# EAGLE design OttoPi04a (EAGLE 9.6.2)
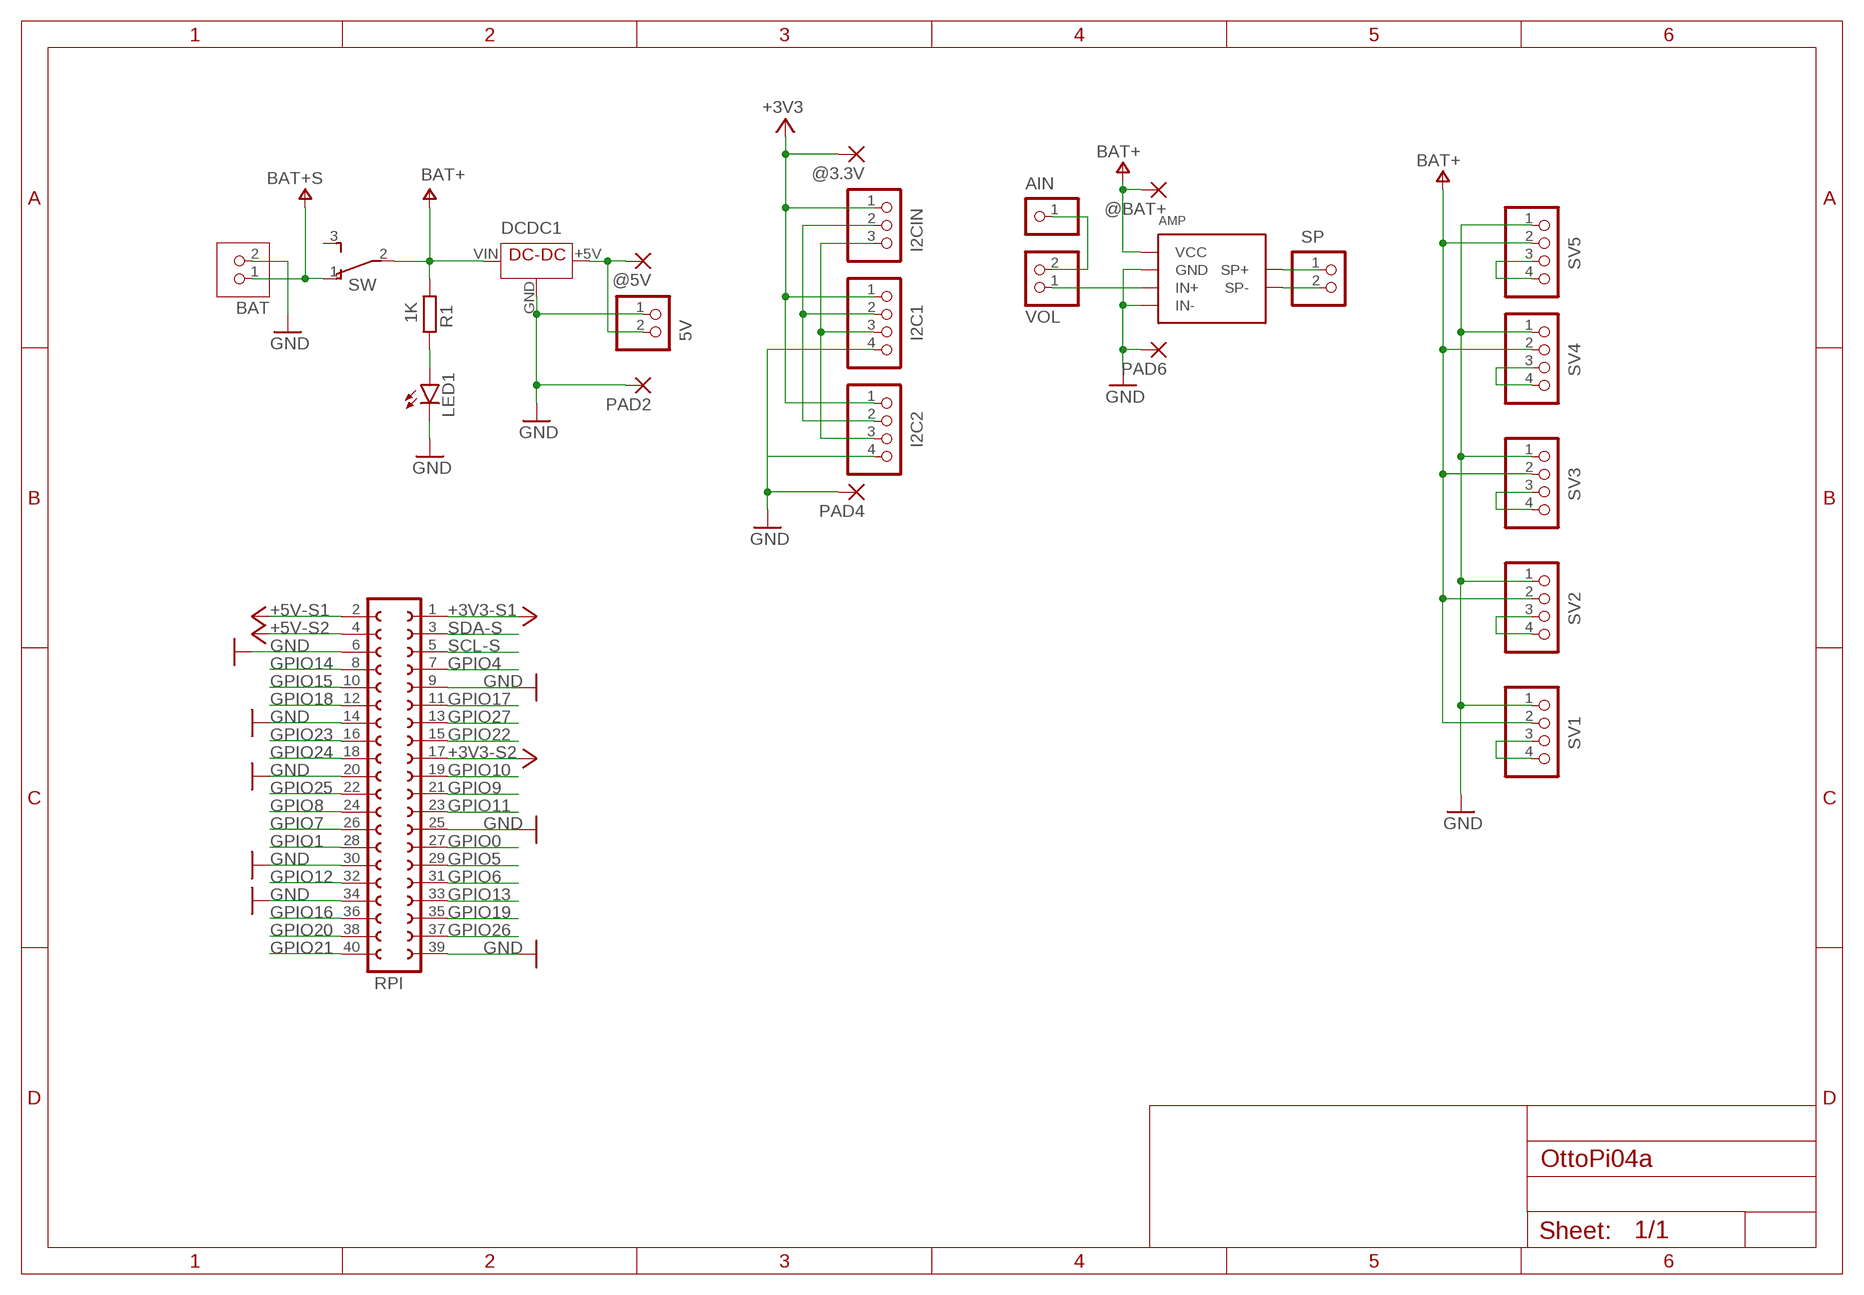
[diagram p0: schematic, sheet 1]

## Parts
5V  PINHD-1X2  [1X02]
@3.3V  1,6/0,9  [1,6/0,9]
@5V  1,6/0,9  [1,6/0,9]
@BAT+  1,6/0,9  [1,6/0,9]
AIN  PINHD-1X1  [1X01]
AMP  PAM8012MOD  [PAM8012MOD-A]
BAT  JST-PH2  [JST-PH2]
DCDC1  DCDC-5V-0.48A  [DCDC-5V-0.48A]
I2C1  PINHD-1X4  [1X04]
I2C2  PINHD-1X4  [1X04]
I2CIN  PINHD-1X3  [1X03]
LED1  LED3MM  [LED3MM]
PAD2  1,6/0,9  [1,6/0,9]
PAD4  1,6/0,9  [1,6/0,9]
PAD6  1,6/0,9  [1,6/0,9]
R1  1K  R-EU_0204/7  [0204/7]
RPI  FE20-2  [FE20-2]
SP  PINHD-1X2  [1X02]
SV1  PINHD-1X4  [1X04]
SV2  PINHD-1X4  [1X04]
SV3  PINHD-1X4  [1X04]
SV4  PINHD-1X4  [1X04]
SV5  PINHD-1X4  [1X04]
SW  TL36PO  [TL3XPO]
VOL  PINHD-1X2  [1X02]

## Nets
+3V3: @3.3V.1(P) I2C1.1 I2C2.1 I2CIN.1
+3V3-S1: RPI.1 ; supply symbol labelled +3V3
+3V3-S2: RPI.17 ; supply symbol labelled +3V3
+4V_S: BAT.1 SW.1(O) ; supply symbol labelled BAT+S
+5V: 5V.2 @5V.1(P) DCDC1.+5V(VOUT)
+5V-S1: RPI.2 ; supply symbol labelled +5V
+5V-S2: RPI.4 ; supply symbol labelled +5V
AIN: AMP.IN+ VOL.1
GND: 5V.1 AMP.GND AMP.IN- BAT.2 DCDC1.GND I2C1.4 I2C2.4 LED1.K(C) PAD2.1(P) PAD4.1(P) PAD6.1(P) RPI.6 RPI.9 RPI.14 RPI.20 RPI.25 RPI.30 RPI.34 RPI.39 SV1.1 SV2.1 SV3.1 SV4.1 SV5.1
GPIO0: RPI.27
GPIO1: RPI.28
GPIO4: RPI.7
GPIO5: RPI.29
GPIO6: RPI.31
GPIO7: RPI.26
GPIO8: RPI.24
GPIO9: RPI.21
GPIO10: RPI.19
GPIO11: RPI.23
GPIO12: RPI.32
GPIO13: RPI.33
GPIO14: RPI.8
GPIO15: RPI.10
GPIO16: RPI.36
GPIO17: RPI.11
GPIO18: RPI.12
GPIO19: RPI.35
GPIO20: RPI.38
GPIO21: RPI.40
GPIO22: RPI.15
GPIO23: RPI.16
GPIO24: RPI.18
GPIO25: RPI.22
GPIO26: RPI.37
GPIO27: RPI.13
LED: LED1.A R1.1
N$1: AIN.1 VOL.2
SCL: I2C1.3 I2C2.3 I2CIN.3
SCL-S: RPI.5
SDA-S: RPI.3
SDL: I2C1.2 I2C2.2 I2CIN.2
SP+: AMP.SP+@1(SP+) SP.1
SP-: AMP.SP-@1(SP-) SP.2
SV1: SV1.3 SV1.4
SV2: SV2.3 SV2.4
SV3: SV3.3 SV3.4
SV4: SV4.3 SV4.4
SV5: SV5.3 SV5.4
V+: @BAT+.1(P) AMP.V+(VCC) DCDC1.VIN R1.2 SV1.2 SV2.2 SV3.2 SV4.2 SV5.2 SW.2(P) ; supply symbol labelled BAT+
Unconnected: SW.3(S)

## Library data of the parts
5V SP VOL = pinhead:PINHD-1X2: PIN HEADER
@3.3V @5V @BAT+ PAD2 PAD4 PAD6 = wirepad:1,6/0,9: THROUGH-HOLE PAD
AIN = pinhead:PINHD-1X1: PIN HEADER
AMP = ytani1:PAM8012MOD: PAM8012使用2W D級アンプモジュール https://akizukidenshi.com/catalog/g/gK-08217/ Vin: 2.5V-5.5V 8ohm: 1W 4ohm: 2W IN-をGNDに接続することでシングルエンド入力としても使用できます。; CHIP1: PAM8012; OC_AKIZUKI: K-08217; URL_AKIZUKI: https://akizukidenshi.com/catalog/g/gK-08217/
BAT = ytani1:JST-PH2
DCDC1 = ytani1:DCDC-5V-0.48A: DC-DC step up converter T64 https://www.amazon.co.jp/gp/product/B07N8TBJB3/ Vin: 0.9V-5V Vout: 5V; URL_AMAZON: https://www.amazon.co.jp/gp/product/B07N8TBJB3/
I2C1 I2C2 SV1-SV5 = pinhead:PINHD-1X4: PIN HEADER
I2CIN = pinhead:PINHD-1X3: PIN HEADER
LED1 = led:LED: LED OSRAM: - CHIPLED LG R971, LG N971, LY N971, LG Q971, LY Q971, LO R971, LY R971 LH N974, LH R974 LS Q976, LO Q976, LY Q976 LO Q996 - Hyper CHIPLED LW Q18S LB Q993, LB Q99A, LB R99A - SideLED LS A670, LO A670, LY A670, LG A670, LP A670 LB A673, LV A673, LT A673, LW A673 LH A674 LY A675 LS A676, LA A676, LO A676, LY A676, LW A676 LS A679, LY A679, LG A679 - Hyper Micro SIDELED® LS Y876, LA Y876, LO Y876, LY Y876 LT Y87S - SmartLED LW L88C, LW L88S LB L89C, LB L89S, LG L890 LS L89K, LO L89K, LY L89K LS L896, LA L896, LO L896, LY L896 - TOPLED LS T670, LO T670, LY T670, LG T670, LP T670 LSG T670, LSP T670, LSY T670, LOP T670, LYG T670 LG T671, LOG T671, LSG T671 LB T673, LV T673, LT T673, LW T673 LH T674 LS T676, LA T676, LO T676, LY T676, LB T676, LH T676, LSB T676, LW T676 LB T67C, LV T67C, LT T67C, LS T67K, LO T67K, LY T67K, LW E67C LS E67B, LA E67B, LO E67B, LY E67B, LB E67C, LV E67C, LT E67C LW T67C LS T679, LY T679, LG T679 LS T770, LO T770, LY T770, LG T770, LP T770 LB T773, LV T773, LT T773, LW T773 LH T774 LS E675, LA E675, LY E675, LS T675 LS T776, LA T776, LO T776, LY T776, LB T776 LHGB T686 LT T68C, LB T68C - Hyper Mini TOPLED® LB M676 - Mini TOPLED Santana® LG M470 LS M47K, LO M47K, LY M47K Source: http://www.osram.convergy.de LUXEON: - LUMILED® LXK2-PW12-R00, LXK2-PW12-S00, LXK2-PW14-U00, LXK2-PW14-V00 LXK2-PM12-R00, LXK2-PM12-S00, LXK2-PM14-U00 LXK2-PE12-Q00, LXK2-PE12-R00, LXK2-PE12-S00, LXK2-PE14-T00, LXK2-PE14-U00 LXK2-PB12-K00, LXK2-PB12-L00, LXK2-PB12-M00, LXK2-PB14-N00, LXK2-PB14-P00, LXK2-PB14-Q00 LXK2-PR12-L00, LXK2-PR12-M00, LXK2-PR14-Q00, LXK2-PR14-R00 LXK2-PD12-Q00, LXK2-PD12-R00, LXK2-PD12-S00 LXK2-PH12-R00, LXK2-PH12-S00 LXK2-PL12-P00, LXK2-PL12-Q00, LXK2-PL12-R00 Source: www.luxeon.com KINGBRIGHT: KA-3528ASYC Source: www.kingbright.com
R1 = rcl:R-EU_: RESISTOR, European symbol; SPICEPREFIX: R
RPI = con-lsta:FE20-2: FEMALE HEADER; OC_FARNELL: unknown; OC_NEWARK: unknown
SW = switch:TL36PO: TINY SWITCH ON - ON Source: http://www2.produktinfo.conrad.com/datenblaetter/700000-724999/705152-da-01-de-Subminiaturschalter_TL_36YO.pdf

## Net classes
0 default: clearance 0.254 mm
1 V+: width 0.1 mm

## Board
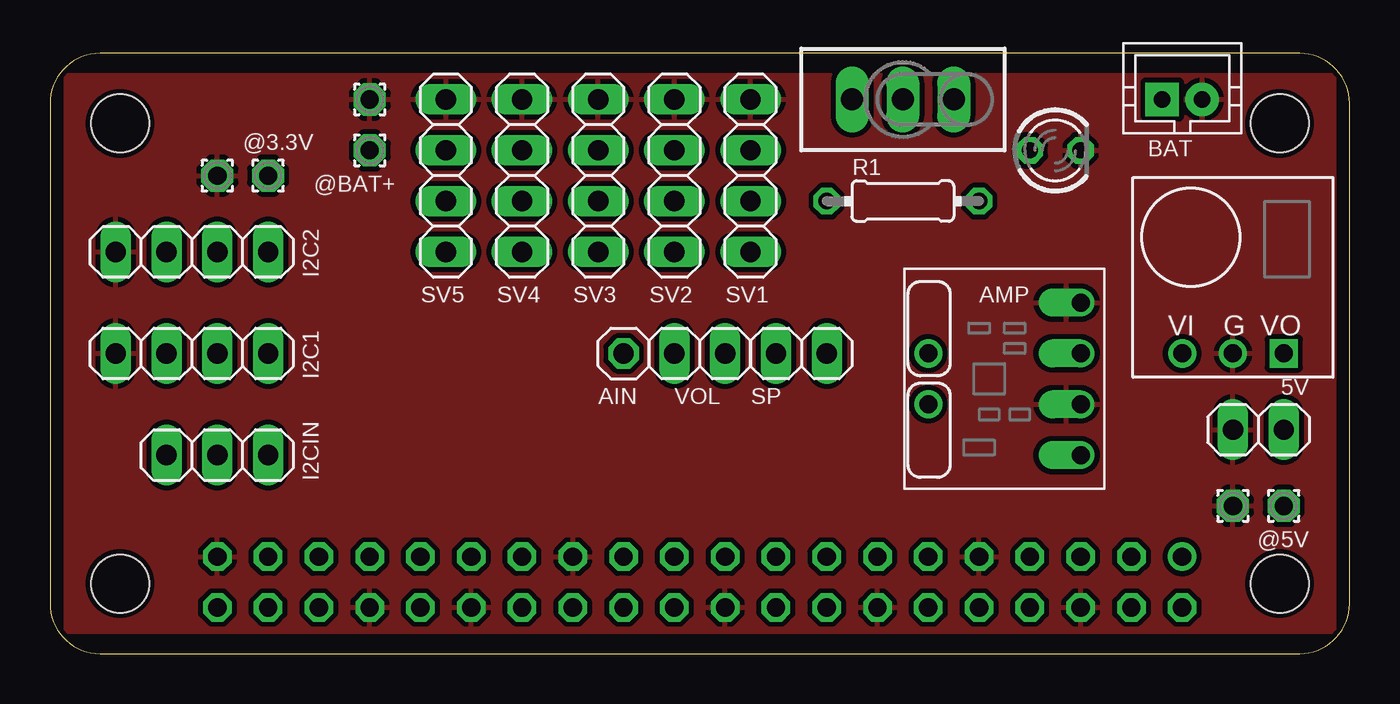
[diagram p1: board, top side]
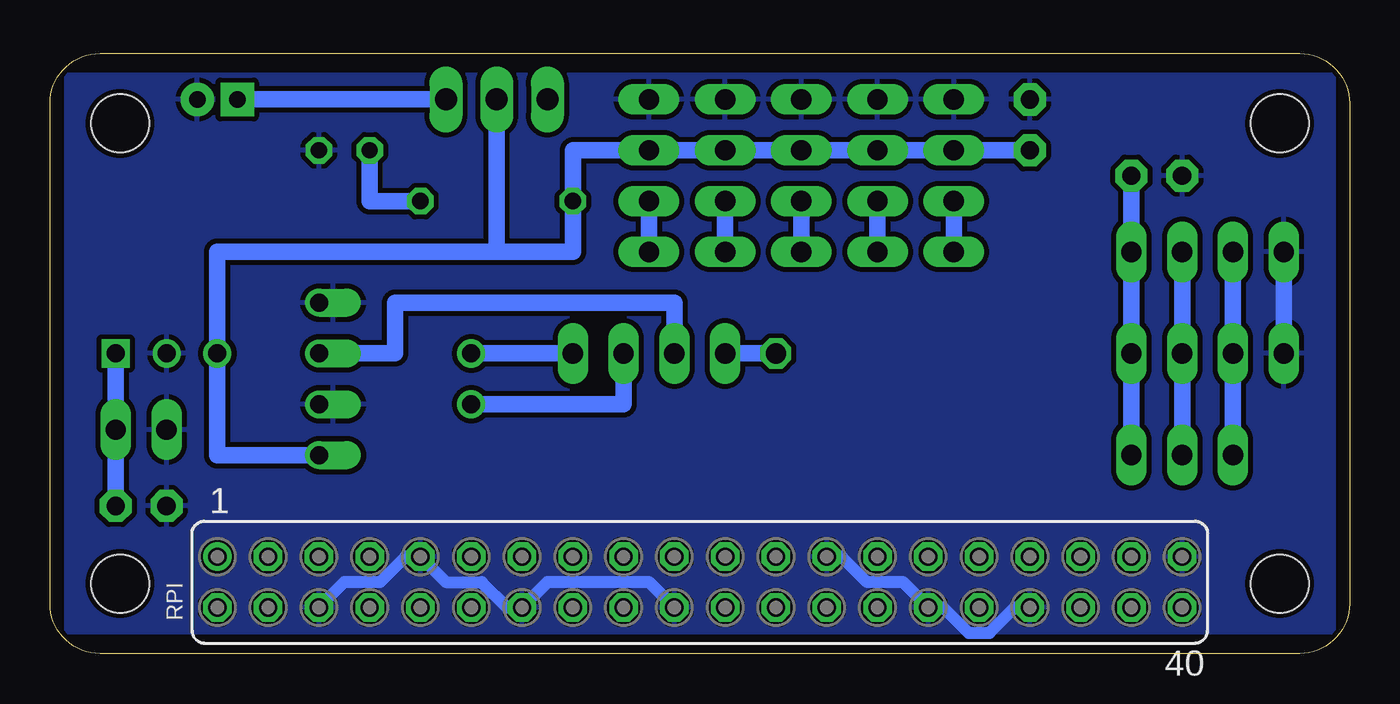
[diagram p2: board, bottom side, seen from below]

Size 65 x 30 mm. Coordinates in mm from the lower left corner, seen from the top.
Outline: 0,27.5 0,2.5 arc90 2.5,0 62.5,0 arc90 65,2.5 65,27.5 arc90 62.5,30 2.5,30 arc90 0,27.5
Copper layers (1*16): Top 0.035mm / dielectric 1.5mm / Bottom 0.035mm
Design rules "SeeedStudio_2layer_DRU_no_angle_20140221": minimum track width 6mil, minimum drill 12mil, track to track 6mil, track to pad 6mil, pad to pad 6mil, via to via 6mil, smd to smd 0mil, copper to edge 10mil, drill to drill 10mil, minimum pad ring 10mil, minimum via ring 6mil, stop-mask expansion 2mil, vias tented up to drill 100mil, thermal gap 10mil
Holes 2.9 mm at 3.5,3.5 61.5,3.5 3.5,26.5 61.5,26.5

### Footprints (pad centres in the part's own frame; a part is rotated, then mirrored left to right if it is on the bottom)
1X02 = drill 1.016 long: 1 -1.27,0; 2 1.27,0
1,6/0,9 = drill 0.914 pad 1.6 octagon: 1 0,0
1X01 = drill 1.016 octagon: 1 0,0
PAM8012MOD-A = drill 0.9 offset: GND -3.81,1.27; IN+ -3.81,-1.27; IN- -3.81,-3.81; V+ -3.81,3.81 | drill 0.9: SP+@1 3.81,1.27; SP-@1 3.81,-1.27
JST-PH2 = drill 0.813 pad 1.676 square: 1 -1,0 | drill 0.813 pad 1.676: 2 1,0
DCDC-5V-0.48A = drill 0.9 square: +5V -2.54,3.81 | drill 0.9: GND 0,3.81; VIN 2.54,3.81
1X04 = drill 1.016 long: 1 -3.81,0; 2 -1.27,0; 3 1.27,0; 4 3.81,0
1X03 = drill 1.016 long: 1 -2.54,0; 2 0,0; 3 2.54,0
LED3MM = drill 0.813 octagon: A -1.27,0; K 1.27,0
0204/7 = drill 0.813 octagon: 1 -3.81,0; 2 3.81,0
FE20-2 = drill 0.914: 1 -24.13,1.27 | drill 0.914 octagon: 2 -24.13,-1.27; 3 -21.59,1.27; 4 -21.59,-1.27; 5 -19.05,1.27; 6 -19.05,-1.27; 7 -16.51,1.27; 8 -16.51,-1.27; 9 -13.97,1.27; 10 -13.97,-1.27; 11 -11.43,1.27; 12 -11.43,-1.27; 13 -8.89,1.27; 14 -8.89,-1.27; 15 -6.35,1.27; 16 -6.35,-1.27; 17 -3.81,1.27; 18 -3.81,-1.27; 19 -1.27,1.27; 20 -1.27,-1.27; 21 1.27,1.27; 22 1.27,-1.27; 23 3.81,1.27; 24 3.81,-1.27; 25 6.35,1.27; 26 6.35,-1.27; 27 8.89,1.27; 28 8.89,-1.27; 29 11.43,1.27; 30 11.43,-1.27; 31 13.97,1.27; 32 13.97,-1.27; 33 16.51,1.27; 34 16.51,-1.27; 35 19.05,1.27; 36 19.05,-1.27; 37 21.59,1.27; 38 21.59,-1.27; 39 24.13,1.27; 40 24.13,-1.27
TL3XPO = drill 1.1 pad 1.422 long: 1 -2.54,0; 2 0,0; 3 2.54,0

### Placement (x,y rotation side)
5V  60.44,11.19 0 top
@3.3V  10.91,23.89 0 top
@5V  61.71,7.38 0 top
@BAT+  15.99,25.16 0 top
AIN  28.69,15 90 top
AMP  47.74,13.73 180 top
BAT  56.63,27.7 0 top
DCDC1  59.17,18.81 180 top
I2C1  7.1,15 180 top
I2C2  7.1,20.08 180 top
I2CIN  8.37,9.92 180 top
LED1  50.28,25.16 0 top
PAD2  59.17,7.38 0 top
PAD4  8.37,23.89 0 top
PAD6  15.99,27.7 0 top
R1  42.66,22.62 180 top
RPI  32.5,3.57 0 bottom
SP  37.58,15 0 top
SV1  35.04,23.89 270 top
SV2  31.23,23.89 270 top
SV3  27.42,23.89 270 top
SV4  23.61,23.89 270 top
SV5  19.8,23.89 270 top
SW  42.66,27.7 180 top
VOL  32.5,15 180 top

### Tracks (layer width: path | path; a pad name or v marks a point on that pad's centre or on a via)
+3V3
  Bottom 0.813: I2CIN.1 I2C1.1 I2C2.1 @3.3V.1
+4V_S
  Bottom 0.813: BAT.1 SW.1
+5V
  Bottom 0.813: DCDC1.+5V 5V.2 @5V.1
AIN
  Bottom 0.813: VOL.1 33.77,17.54 47.74,17.54 47.74,15 AMP.IN+
GND
  Bottom 0.61: RPI.6 50.28,3.57 48.48,3.57 47.21,4.84 RPI.9 45.2,3.57 43.4,3.57 42.13,2.3 RPI.14 40.12,3.57 35.04,3.57 RPI.20 | RPI.25 25.41,4.84 24.14,3.57 22.34,3.57 RPI.30 20.33,2.3 19.06,1.03 18,1.03 16.73,2.3 RPI.34
  Bottom 0.813: 57.9,27.7 BAT.2 | I2C1.4 I2C2.4
  pour Bottom: 0.75,28.97 64.25,28.97 64.25,1.03 0.75,1.03
  pour Top: 0.75,28.97 64.25,28.97 64.25,1.03 0.75,1.03
LED
  Bottom 0.813: R1.1 49.01,22.62 LED1.A
N$1
  Bottom 0.813: VOL.2 AIN.1
SCL
  Bottom 0.813: I2CIN.3 I2C1.3 I2C2.3
SDL
  Bottom 0.813: I2CIN.2 I2C1.2 I2C2.2
SP+
  Bottom 0.813: SP.1 36.31,12.46 AMP.SP+@1
SP-
  Bottom 0.813: AMP.SP-@1 SP.2
SV1
  Bottom 0.813: SV1.4 SV1.3
SV2
  Bottom 0.813: SV2.3 SV2.4
SV3
  Bottom 0.813: SV3.4 SV3.3
SV4
  Bottom 0.813: SV4.3 SV4.4
SV5
  Bottom 0.813: SV5.4 SV5.3
V+
  Bottom 0.813: 42.66,20.08 38.85,20.08 R1.2 38.85,25.16 SV1.2 SV2.2 SV3.2 SV4.2 SV5.2 @BAT+.1 | SW.2 42.66,20.08 | AMP.V+ 56.63,9.92 DCDC1.VIN 56.63,20.08 42.66,20.08